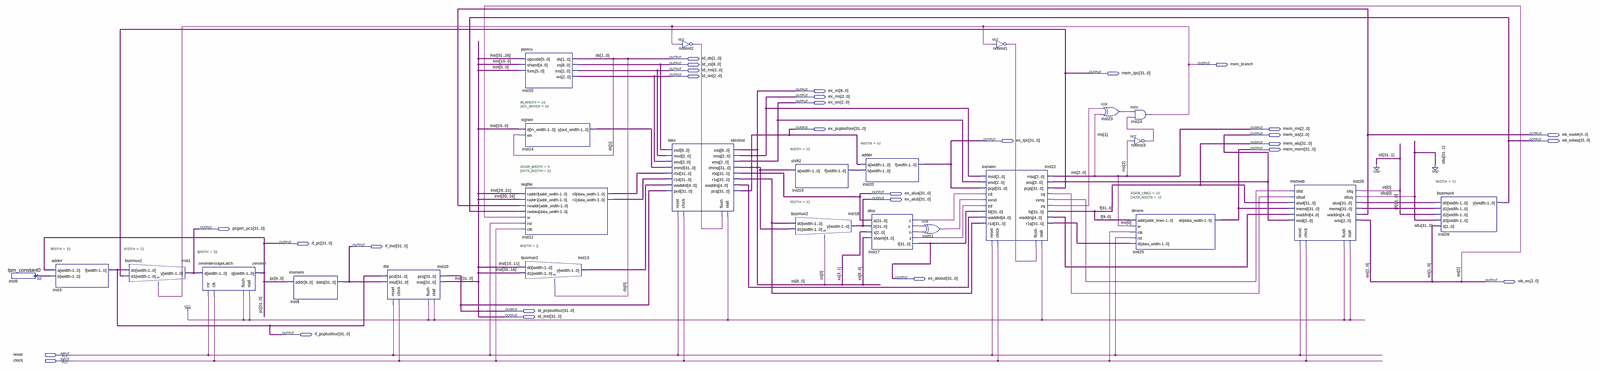
[diagram p0: schematic sheet, whole]
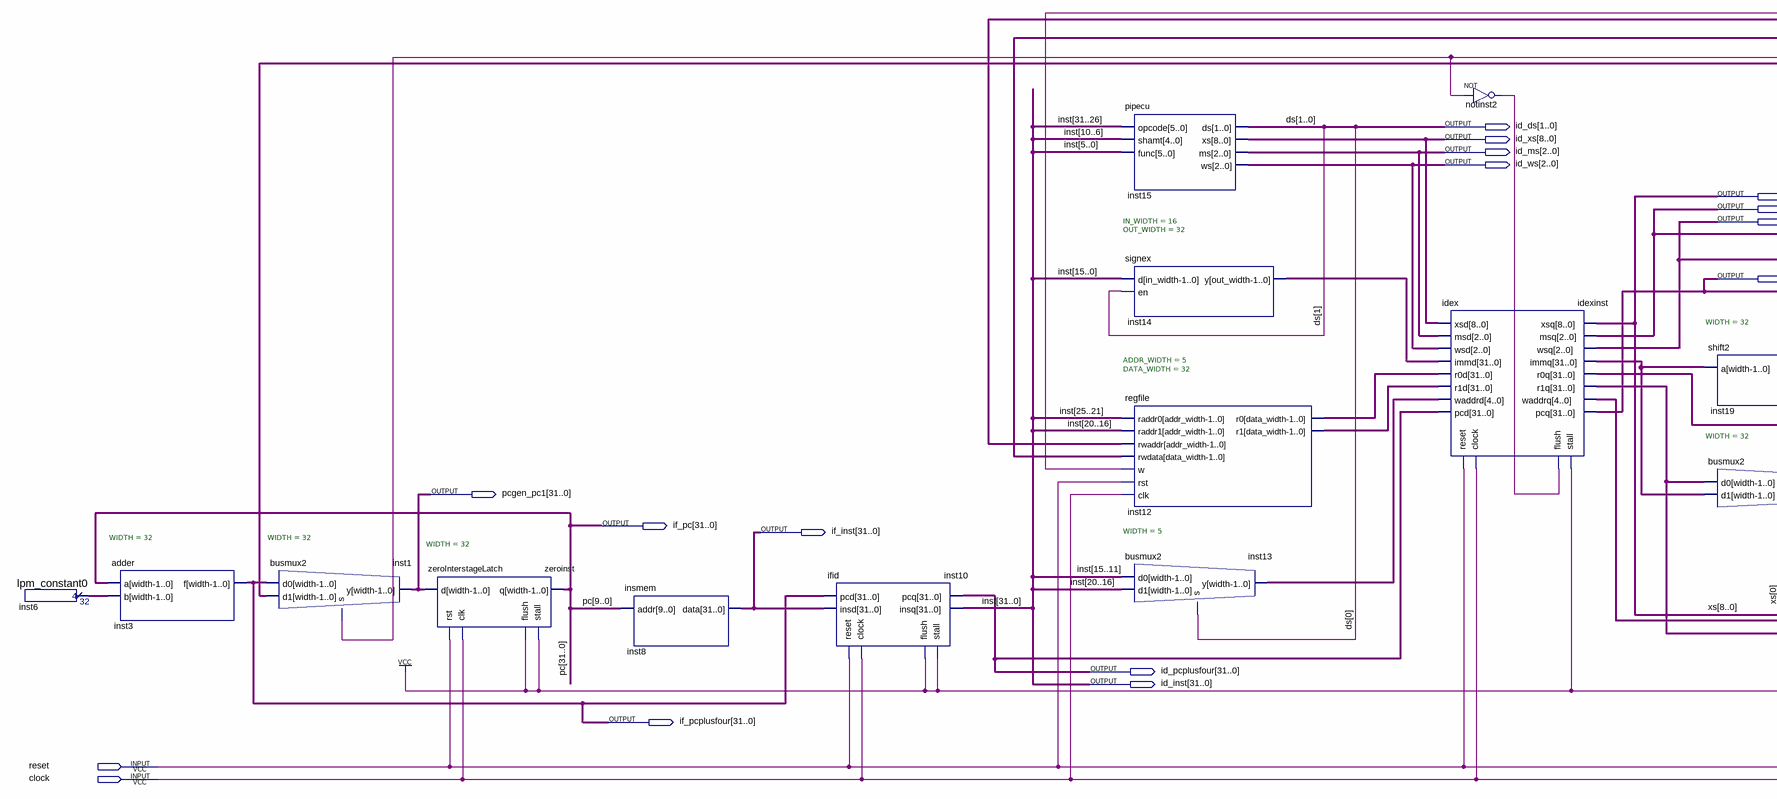
[diagram p1: schematic sheet, left part]
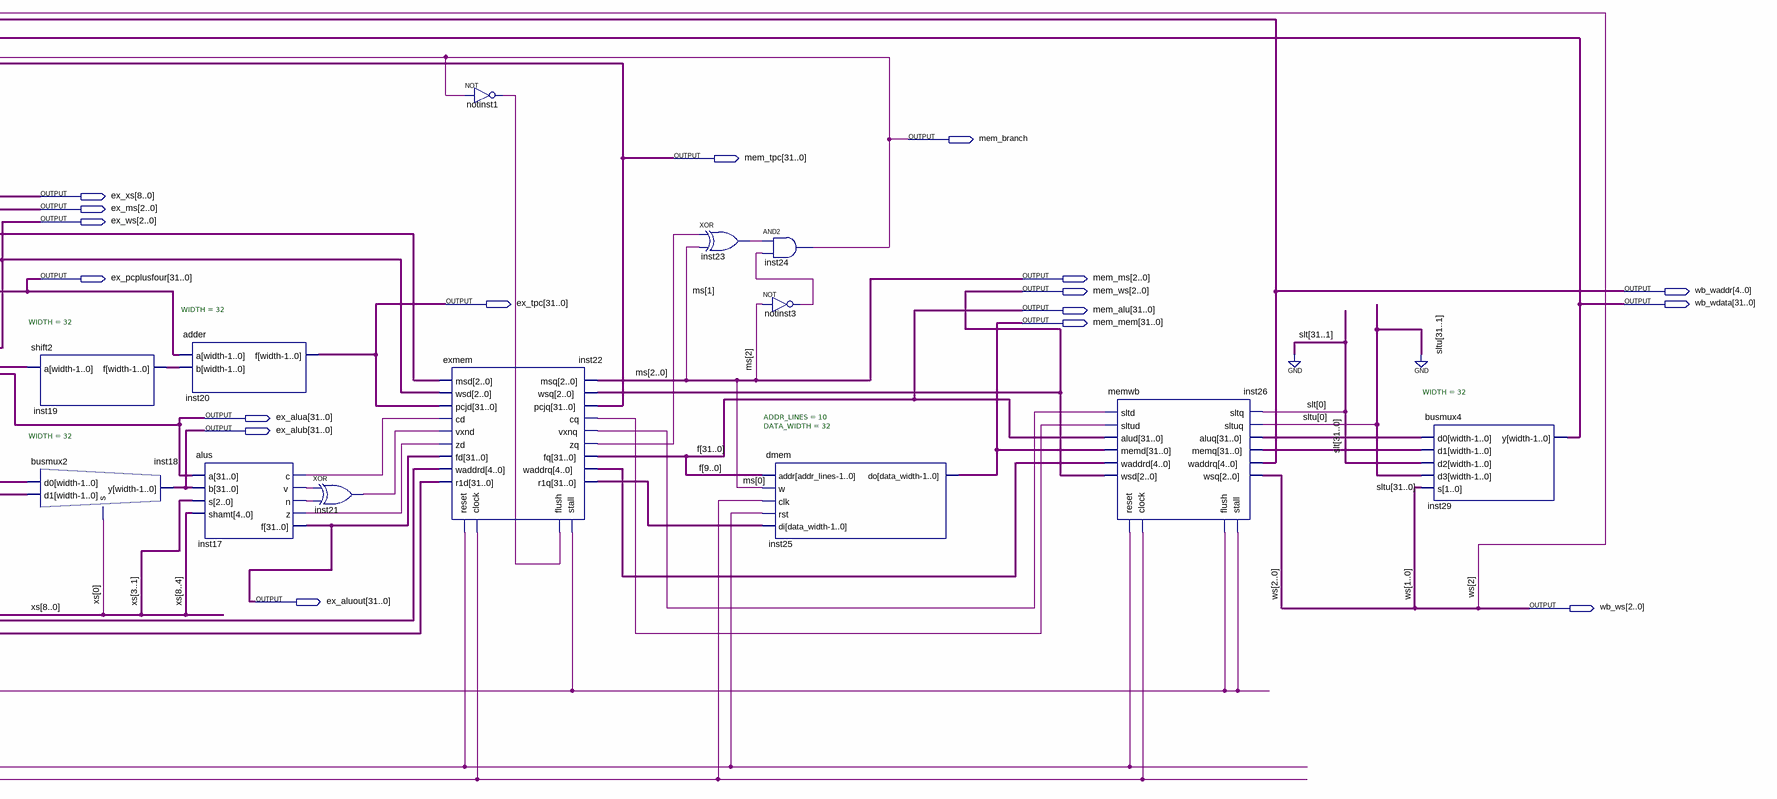
[diagram p2: schematic sheet, right part]
// Quartus schematic pipeline.bdf as structural Verilog: 25 symbols, 29 pins
module pipeline (
  input  reset,
  input  clock,
  output [1:0] id_ds,
  output [8:0] id_xs,
  output mem_branch,
  output [2:0] id_ms,
  output [31:0] mem_tpc,
  output [2:0] id_ws,
  output [8:0] ex_xs,
  output [2:0] ex_ms,
  output [2:0] ex_ws,
  output [31:0] ex_pcplusfour,
  output [2:0] mem_ms,
  output [2:0] mem_ws,
  output [4:0] wb_waddr,
  output [31:0] ex_tpc,
  output [31:0] wb_wdata,
  output [31:0] mem_alu,
  output [31:0] mem_mem,
  output [31:0] ex_alua,
  output [31:0] ex_alub,
  output [31:0] pcgen_pc1,
  output [31:0] if_pc,
  output [31:0] if_inst,
  output [31:0] ex_aluout,
  output [2:0] wb_ws,
  output [31:0] id_pcplusfour,
  output [31:0] id_inst,
  output [31:0] if_pcplusfour
);

  wire inst17_c, inst17_n, inst17_v, inst17_z, inst21_out, inst22_cq, inst22_vxnq, inst22_zq, inst23_out,
       notinst1_out, notinst2_out, notinst3_out;
  wire [0:0] slt, sltu;
  wire [4:0] idexinst_waddrq, inst13_y, inst22_waddrq;
  wire [31:0] idexinst_immq, idexinst_r1q, inst6_result, inst12_r0, inst12_r1, inst14_y, inst19_f,
       inst22_r1q, inst26_aluq, inst26_memq;

  lpm_constant0 inst6 (.result(inst6_result));
  adder #(.WIDTH(32)) inst3 (.a(if_pc), .b(inst6_result), .f(if_pcplusfour));
  busmux2 #(.WIDTH(32)) inst1 (.d0(if_pcplusfour), .d1(mem_tpc), .s(mem_branch), .y(pcgen_pc1));
  zeroInterstageLatch #(.WIDTH(32)) zeroinst (
    .d(pcgen_pc1), .rst(reset), .clk(clock), .flush(1'b1), .stall(1'b1), .q(if_pc));
  insmem inst8 (.addr(if_pc[9:0]), .data(if_inst));
  ifid inst10 (
    .pcd(if_pcplusfour), .insd(if_inst), .reset(reset), .clock(clock), .flush(1'b1), .stall(1'b1),
    .pcq(id_pcplusfour), .insq(id_inst));
  pipecu inst15 (
    .opcode(id_inst[31:26]), .shamt(id_inst[10:6]), .func(id_inst[5:0]), .ds(id_ds), .xs(id_xs), .ms(id_ms),
    .ws(id_ws));
  signex #(.IN_WIDTH(16), .OUT_WIDTH(32)) inst14 (.d(id_inst[15:0]), .en(id_ds[1]), .y(inst14_y));
  regfile #(.ADDR_WIDTH(5), .DATA_WIDTH(32)) inst12 (
    .raddr0(id_inst[25:21]), .raddr1(id_inst[20:16]), .rwaddr(wb_waddr), .rwdata(wb_wdata), .w(wb_ws[2]),
    .rst(reset), .clk(clock), .r0(inst12_r0), .r1(inst12_r1));
  busmux2 #(.WIDTH(5)) inst13 (.d0(id_inst[15:11]), .d1(id_inst[20:16]), .s(id_ds[0]), .y(inst13_y));
  idex idexinst (
    .xsd(id_xs), .msd(id_ms), .wsd(id_ws), .immd(inst14_y), .r0d(inst12_r0), .r1d(inst12_r1),
    .waddrd(inst13_y), .pcd(id_pcplusfour), .reset(reset), .clock(clock), .flush(notinst2_out), .stall(1'b1),
    .xsq(ex_xs), .msq(ex_ms), .wsq(ex_ws), .immq(idexinst_immq), .r0q(ex_alua), .r1q(idexinst_r1q),
    .waddrq(idexinst_waddrq), .pcq(ex_pcplusfour));
  not notinst2 (notinst2_out, mem_branch);
  shift2 #(.WIDTH(32)) inst19 (.a(idexinst_immq), .f(inst19_f));
  busmux2 #(.WIDTH(32)) inst18 (.d0(idexinst_r1q), .d1(idexinst_immq), .s(ex_xs[0]), .y(ex_alub));
  adder #(.WIDTH(32)) inst20 (.a(ex_pcplusfour), .b(inst19_f), .f(ex_tpc));
  alus inst17 (
    .a(ex_alua), .b(ex_alub), .s(ex_xs[3:1]), .shamt(ex_xs[8:4]), .c(inst17_c), .v(inst17_v), .n(inst17_n),
    .z(inst17_z), .f(ex_aluout));
  xor inst21 (inst21_out, inst17_v, inst17_n);
  not notinst1 (notinst1_out, mem_branch);
  exmem inst22 (
    .msd(ex_ms), .wsd(ex_ws), .pcjd(ex_tpc), .cd(inst17_c), .vxnd(inst21_out), .zd(inst17_z), .fd(ex_aluout),
    .waddrd(idexinst_waddrq), .r1d(idexinst_r1q), .reset(reset), .clock(clock), .flush(notinst1_out),
    .stall(1'b1), .msq(mem_ms), .wsq(mem_ws), .pcjq(mem_tpc), .cq(inst22_cq), .vxnq(inst22_vxnq),
    .zq(inst22_zq), .fq(mem_alu), .waddrq(inst22_waddrq), .r1q(inst22_r1q));
  xor inst23 (inst23_out, inst22_zq, mem_ms[1]);
  and inst24 (mem_branch, inst23_out, notinst3_out);
  not notinst3 (notinst3_out, mem_ms[2]);
  dmem #(.ADDR_LINES(10), .DATA_WIDTH(32)) inst25 (
    .addr(mem_alu[9:0]), .w(mem_ms[0]), .clk(clock), .rst(reset), .di(inst22_r1q), .\do (mem_mem));
  memwb inst26 (
    .sltd(inst22_vxnq), .sltud(inst22_cq), .alud(mem_alu), .memd(mem_mem), .waddrd(inst22_waddrq),
    .wsd(mem_ws), .reset(reset), .clock(clock), .flush(1'b1), .stall(1'b1), .sltq(slt[0]), .sltuq(sltu[0]),
    .aluq(inst26_aluq), .memq(inst26_memq), .waddrq(wb_waddr), .wsq(wb_ws));
  busmux4 #(.WIDTH(32)) inst29 (
    .d0(inst26_aluq), .d1(inst26_memq), .d2({{31{1'b0}}, slt[0]}), .d3({{31{1'b0}}, sltu[0]}),
    .s(wb_ws[1:0]), .y(wb_wdata));

  // Other names for the same wires on the sheet: ds[1:0] = id_ds; xs[8:0] = ex_xs; inst[31:0] = id_inst;
  //   f[31:0] = mem_alu; ms[2:0] = mem_ms; pc[31:0] = if_pc; ws[2:0] = wb_ws
endmodule
